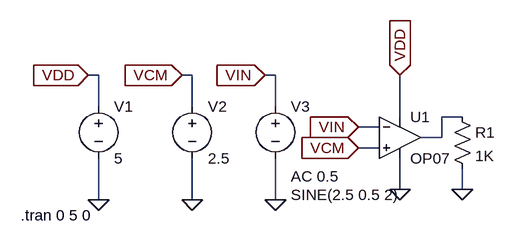
[diagram p0: schematic 1 bit ADC.asc]
1 bit ADC.asc, the LTspice schematic file:
Version 4.1
SHEET 1 880 680
WIRE 96 32 80 32
WIRE 240 32 224 32
WIRE 368 32 352 32
WIRE 96 80 96 32
WIRE 240 80 240 32
WIRE 368 80 368 32
WIRE 560 96 560 32
WIRE 656 96 624 96
WIRE 528 112 496 112
WIRE 624 128 624 96
WIRE 624 128 592 128
WIRE 528 144 496 144
WIRE 560 208 560 160
WIRE 656 208 656 176
WIRE 96 224 96 160
WIRE 240 224 240 160
WIRE 368 224 368 160
FLAG 224 32 VCM
IOPIN 224 32 In
FLAG 352 32 VIN
IOPIN 352 32 In
FLAG 96 224 0
FLAG 240 224 0
FLAG 368 224 0
FLAG 560 32 VDD
IOPIN 560 32 In
FLAG 496 112 VIN
IOPIN 496 112 In
FLAG 496 144 VCM
IOPIN 496 144 In
FLAG 560 208 0
FLAG 656 208 0
FLAG 80 32 VDD
IOPIN 80 32 In
SYMBOL voltage 96 64 R0
SYMATTR InstName V1
SYMATTR Value 5
SYMBOL voltage 240 64 R0
WINDOW 123 0 0 Left 0
WINDOW 39 0 0 Left 0
SYMATTR InstName V2
SYMATTR Value 2.5
SYMBOL voltage 368 64 R0
WINDOW 123 24 124 Left 2
WINDOW 39 0 0 Left 0
WINDOW 3 24 152 Left 2
SYMATTR Value2 AC 0.5
SYMATTR InstName V3
SYMATTR Value SINE(2.5 0.5 2)
SYMBOL OpAmps\\OP07 560 64 R0
SYMATTR InstName U1
SYMBOL res 640 80 R0
SYMATTR InstName R1
SYMATTR Value 1K
SYMATTR SpiceLine tol=1 pwr=0.1
TEXT -24 248 Left 2 !.tran 0 5 0

The netlist it stands for:
* 1 bit ADC.asc
V1 VDD 0 5
V2 VCM 0 2.5
V3 VIN 0 SINE(2.5 0.5 2) AC 0.5
X§U1 VCM VIN VDD 0 N001 LT1001  ; OP07, pins In+ In- V+ V- OUT
R1 N001 0 1K tol=1 pwr=0.1
.tran 0 5 0
.lib LTC.lib
.backanno
.end